# Altium schematic sheet Isolation_Rev2.SchDoc
size A
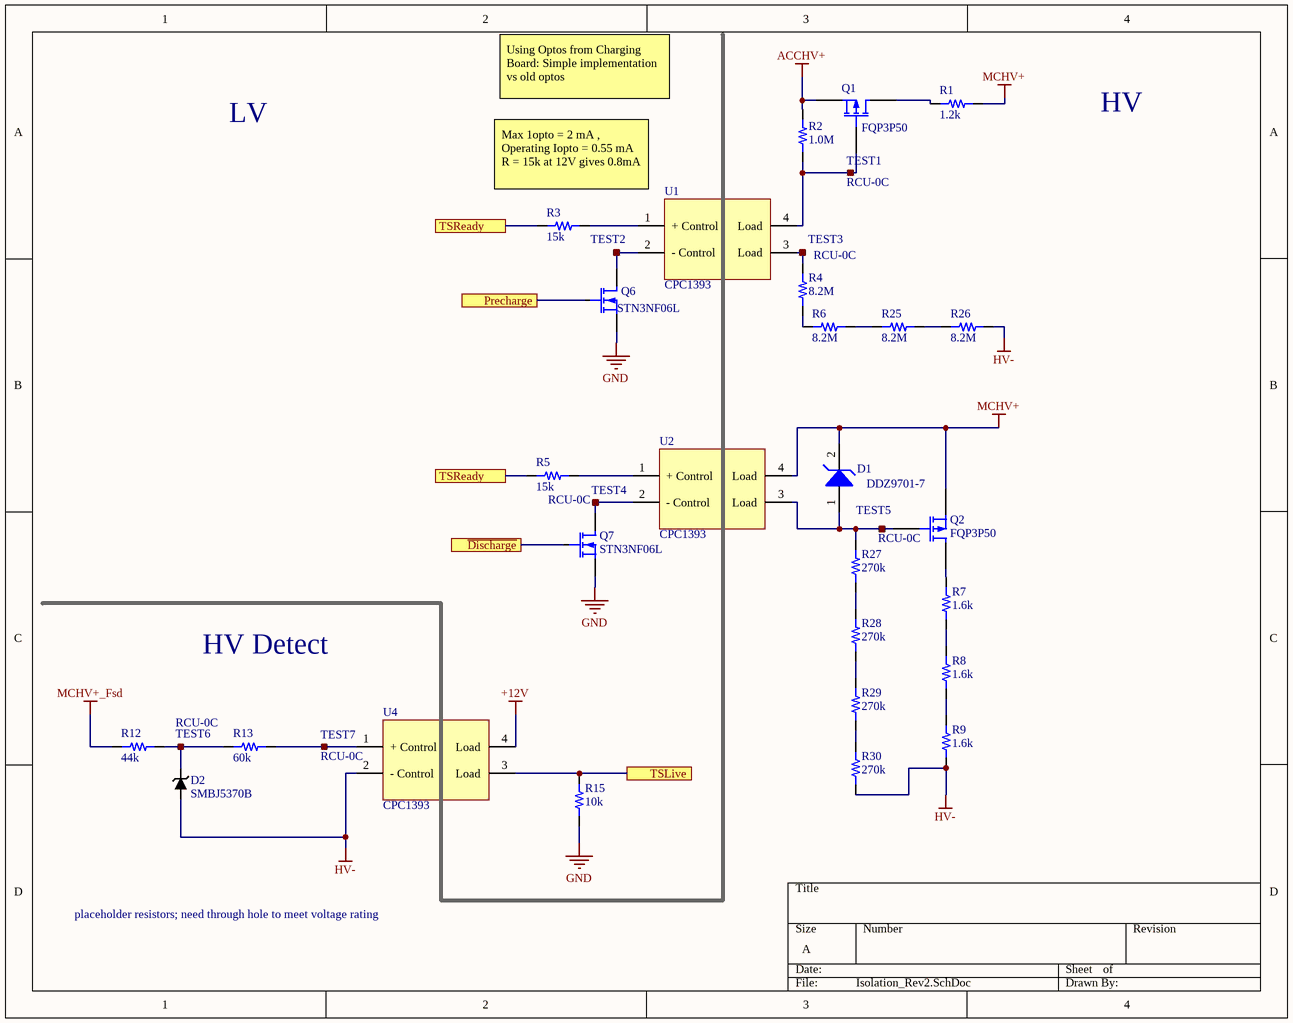
[diagram p0: Isolation_Rev2.SchDoc]

## Parts
D1  DDZ9701-7  [SOD123F]
D2  SMBJ5370B  [SMBJ5370B-TP]
Q1  FQP3P50  [TO-220AB]
Q2  FQP3P50  [TO-220AB]
Q6  STN3NF06L  [STN3NF06L]
Q7  STN3NF06L  [STN3NF06L]
R1  value 1.2k  [AP101]  (hidden comment: Resistor 1k2 100W 1% Throughhole)
R2  value 1.0M  [RES 0603/1608]  (hidden comment: Resistor 1.0M 0603 1/10W 10%)
R3  value 15k  [RES 0603/1608]  (hidden comment: Resistor 3.0k 0603 1/10W 1%)
R4  value 8.2M  [RES 0805/2012]  (hidden comment: Resistor 8.2M 0805 1/4W 5%)
R5  value 15k  [RES 0603/1608]  (hidden comment: Resistor 3.0k 0603 1/10W 1%)
R6  value 8.2M  [RES 0805/2012]  (hidden comment: Resistor 8.2M 0805 1/4W 5%)
R7  value 1.6k  [Axial 52mm Pitch]  (hidden comment: Resistor 1.6k Axial 10W 5%)
R8  value 1.6k  [Axial 52mm Pitch]  (hidden comment: Resistor 1.6k Axial 10W 5%)
R9  value 1.6k  [Axial 52mm Pitch]  (hidden comment: Resistor 1.6k Axial 10W 5%)
R12  value 44k  [Axial 25.4mm Pitch]  (hidden comment: Resistor 2W TH)
R13  value 60k  [Axial 25.4mm Pitch]  (hidden comment: Resistor 2W TH)
R15  value 10k  [RES 0603/1608]  (hidden comment: Resistor 4.7k 0603 1/10W 5%)
R25  value 8.2M  [RES 0805/2012]  (hidden comment: Resistor 8.2M 0805 1/4W 5%)
R26  value 8.2M  [RES 0805/2012]  (hidden comment: Resistor 8.2M 0805 1/4W 5%)
R27  value 270k  [RES 0805/2012]  (hidden comment: Resistor 270k 0805 1/4W 5%)
R28  value 270k  [RES 0805/2012]  (hidden comment: Resistor 270k 0805 1/4W 5%)
R29  value 270k  [RES 0805/2012]  (hidden comment: Resistor 270k 0805 1/4W 5%)
R30  value 270k  [RES 0805/2012]  (hidden comment: Resistor 270k 0805 1/4W 5%)
TEST1  RCU-0C  [RCU-0C]
TEST2  (no value)  [RCU-0C]
TEST3  RCU-0C  [RCU-0C]
TEST4  RCU-0C  [RCU-0C]
TEST5  RCU-0C  [RCU-0C]
TEST6  RCU-0C  [RCU-0C]
TEST7  RCU-0C  [RCU-0C]
U1  CPC1393  [CPC1393GR]
U2  CPC1393  [CPC1393GR]
U4  CPC1393  [CPC1393GR]

## Ports
Precharge, TSLive, TSReady, ~{Discharge}

## Nets
+12V: U4.4(Load)
ACCHV+: Q1.3(S) R2.1
GND: Q6.3(S) Q7.3(S) R15.1
HV-: D2.1 R9.1 R26.1 R30.1 U4.2(-_Control)
MCHV+: D1.2(K) Q2.3(S) R1.2 U2.4(Load)
MCHV+_Fsd: R12.1
~{Discharge}: Q7.1(G) ; port ~{Discharge}
Precharge: Q6.1(G) ; port Precharge
TSLive: R15.2 U4.3(Load) ; port TSLive
TSReady: R3.1 R5.1 ; port TSReady
NetD1_1: D1.1(A) Q2.1(G) R27.2 TEST5.1 U2.3(Load)
NetD2_2: D2.2 R12.2 R13.1 TEST6.1
NetQ1_1: Q1.1(G) R2.2 TEST1.1 U1.4(Load)
NetQ1_2: Q1.2(D) R1.1
NetQ2_2: Q2.2(D) R7.2
NetQ6_2: Q6.2(D) TEST2.1 U1.2(-_Control)
NetQ7_2: Q7.2(D) TEST4.1 U2.2(-_Control)
NetR3_2: R3.2 U1.1(+_Control)
NetR4_1: R4.1 R6.2
NetR4_2: R4.2 TEST3.1 U1.3(Load)
NetR5_2: R5.2 U2.1(+_Control)
NetR6_1: R6.1 R25.2
NetR7_1: R7.1 R8.2
NetR8_1: R8.1 R9.2
NetR13_2: R13.2 TEST7.1 U4.1(+_Control)
NetR25_1: R25.1 R26.2
NetR27_1: R27.1 R28.2
NetR28_1: R28.1 R29.2
NetR29_1: R29.1 R30.2

## Notes on the sheet
- Using Optos from Charging Board: Simple implementation vs old optos
- LV
- HV
- Max 1opto = 2 mA ,          Operating Iopto = 0.55 mA
  R = 15k at 12V gives 0.8mA
- HV Detect
- placeholder resistors; need through hole to meet voltage rating

## Library data of the parts
D1 = 10: Zener Diode 14V 500mW ±5% Surface Mount SOD-123; Manufacturer_id: 8; idDiode: 10; Drawer_id: 1; Value: 14Vz; MfrPartNo: DDZ9701-7; Name: DDZ9701; Type: Zener; Num_Circuits: 1; Power: 500mW; Package: SOD-123; Link: https://www.digikey.com/product-detail/en/diodes-incorporated/DDZ9701-7/DDZ9701-7DICT-ND/3877402; ComponentLink1Description: Datasheet; ComponentLink1URL: https://www.diodes.com/assets/Datasheets/ds30410.pdf; Supplier1: Digi-Key; Supplier1PartNo: DDZ9701-7DICT-ND
D2 = 13: 56V Zener Diode; Manufacturer_id: 1; idDiode: 13; Created_By: Graydon; Drawer_id: 1; Name: SMBJ5370B-TP; Value: 56V; Type: Zener; Num_Circuits: 1; Link: https://www.digikey.com/product-detail/en/micro-commercial-co/SMBJ5370B-TP/SMBJ5370B-TPMSCT-ND/3165257; ComponentLink1Description: Digikey; ComponentLink1URL: https://www.digikey.com/product-detail/en/micro-commercial-co/SMBJ5370B-TP/SMBJ5370B-TPMSCT-ND/3165257; Supplier1: Digikey; Supplier1PartNo: SMBJ5370B-TPMSCT-ND
Q1 Q2 = 5: Manufacturer_id: 1; idFETs: 5; Value: P_Channel; Vdss: 500V; Id: 2.7A; Rds_On: 4Ohms; Vgs(typ): 4.0v; Vgs(Max): 5.0V; Power(Max): 85W; Created_By: Angel; Drawer_id: 1; Name: FQP3P50; Num_Circuits: 1; Package: TO-220; MfrPartNo: FQP3P50; Link: https://www.digikey.com/product-detail/en/on-semiconductor/FQP3P50/FQP3P50-ND/1055021; Supplier1: Digi-Key; Supplier1PartNo: FQP3P50-ND
Q6 Q7 = 8: MOSFET N-CH 60V 4A SOT223; Manufacturer_id: 1; idFETs: 8; Value: N_Channel; Rds_On: 70m; Vgs(Max): +/- 16V; Power(Max): 3.3W; Created_By: Graydon; Drawer_id: 1; Name: STN3NF06L; Vdss: 60V; Num_Circuits: 1; Id: 4A; Package: SOT-233; MfrPartNo: STN3NF06L; Link: https://www.digikey.com/product-detail/en/stmicroelectronics/STN3NF06L/497-3177-1-ND/654516; ComponentLink1Description: Datasheet; ComponentLink1URL: https://www.st.com/content/ccc/resource/technical/document/datasheet/b1/52/93/f0/a9/a9/40/d7/CD00002430.pdf/files/CD00002430.pdf/jcr:content/translations/en.CD00002430.pdf; Supplier1: Digkey; Supplier1PartNo: 497-3177-1-ND; Created_Date: 11/26/2018
R1 = 2705: 100W Throughhole Resistor; Manufacturer_id: 1; idResistor: 2705; Name: AP101 1K2 J; Tolerance: 5%; Created_By: Graydon; Supplier 1: Digi-Key; Supplier Part Number 1: AP1011K2J-ND; Drawer_id: 1; Power: 100W; Package: TO-247-2; MfrPartNo: AP101 1K2 J; Link: https://www.digikey.com/short/jvdcjz; ComponentLink1Description: Datasheet; ComponentLink1URL: https://www.ohmite.com/assets/docs/acl_ap101.pdf?r=false; Created_Date: 2018-11-24
R2 = 2341: Manufacturer_id: 1; idResistor: 2341; Name: Res_1.0M_0603_1/10W_10%; Created_By: Nick Mah; Supplier 1: Digi-Key; Drawer_id: 1; Tolerance: 10%; Power: 1/10W; Package: 0603; ComponentLink1Description: Datasheet; Created_Date: 2018-10-20
R3 R5 = 300: Manufacturer_id: 1; idResistor: 300; Name: Res_3.0k_0603_1/10W_1%; Created_By: Nick Mah; Supplier 1: Digi-Key; Drawer_id: 1; Tolerance: 1%; Power: 1/10W; Package: 0603; ComponentLink1Description: Datasheet; Created_Date: 2018-10-20
R4 R6 R25 R26 = 1895: Manufacturer_id: 1; idResistor: 1895; Name: Res_8.2M_0805_1/4W_5%; Created_By: Nick Mah; Supplier 1: Digi-Key; Drawer_id: 1; Tolerance: 5%; Power: 1/4W; Package: 0805; ComponentLink1Description: Datasheet; Created_Date: 2018-10-20
R7-R9 = 2706: Manufacturer_id: 1; MfrPartNo: SQP10AJB-1K6; idResistor: 2706; Name: Res_1.6k_Axial_10W_5%; Supplier 1: Digi-Key; Supplier Part Number 1: Digi-Key; Drawer_id: 1; Tolerance: 5%; Power: 10W; Package: Axial; Link: https://www.digikey.com/product-detail/en/yageo/SQP10AJB-1K6/1.6KW-10-ND/18787; ComponentLink1Description: Datasheet
R12 R13 = 2707: 2W TH resistor; Manufacturer_id: 1; idResistor: 2707; Name: PR02; Tolerance: 5%; Created_By: Graydon; Supplier Part Number 1: Digi-Key; Drawer_id: 1; Power: 2W; Package: Axial; Link: https://www.digikey.com/product-detail/en/vishay-bc-components/PR02000205101JR500/PPC5.1KW-2CT-ND/597417; ComponentLink1Description: Datasheet; Created_Date: 2018-12-01
R15 = 1385: Manufacturer_id: 1; idResistor: 1385; Name: Res_4.7k_0603_1/10W_5%; Created_By: Nick Mah; Supplier 1: Digi-Key; Drawer_id: 1; Tolerance: 5%; Power: 1/10W; Package: 0603; ComponentLink1Description: Datasheet; Created_Date: 2018-10-20
R27-R30 = 1859: Manufacturer_id: 1; idResistor: 1859; Name: Res_270k_0805_1/4W_5%; Created_By: Nick Mah; Supplier 1: Digi-Key; Drawer_id: 1; Tolerance: 5%; Power: 1/4W; Package: 0805; ComponentLink1Description: Datasheet; Created_Date: 2018-10-20
TEST1-TEST7 = 14: Test point; Manufacturer_id: 1; idConn: 14; Value: CONN; Created_By: Graydon; Updated_By: Null; Drawer_id: 1; Name: RCU-0C; Num_Contacts: 1; Num_Rows: 1; Package: RCU-0C; MfrPartNo: RCU-0C; Link: https://www.digikey.com/product-detail/en/te-connectivity-amp-connectors/RCU-0C/A106145CT-ND/3477802; ComponentLink1Description: Null; ComponentLink1URL: Null; Supplier1: None; Supplier1PartNo: None; Created_Date: 11/10/2018
U1 U2 U4 = 26: Solid State Relay SPST-NO (1 Form A) 4-SMD (0.300", 7.62mm); Manufacturer_id: 1; MfrPartNo: CPC1393GRTR; idIC_Misc: 26; Value: Null; Created_By: Lynette; Drawer_id: 1; Name: CPC1393; Type: Null; Protocol: Null; Num_Circuits: 1; Data_Rate: Null; Vin(Min): Null; Vin(Max): Null; Package: CPC1393GR; Link: https://www.digikey.com/product-detail/en/ixys-integrated-circuits-division/CPC1393GRTR/CLA270CT-ND/1277144; ComponentLink1Description: Null; ComponentLink1URL: Null; Supplier1: Null; Supplier1PartNo: Null; Updated_By: Null